# Altium project Quadcopter_v2.0.PrjPCB
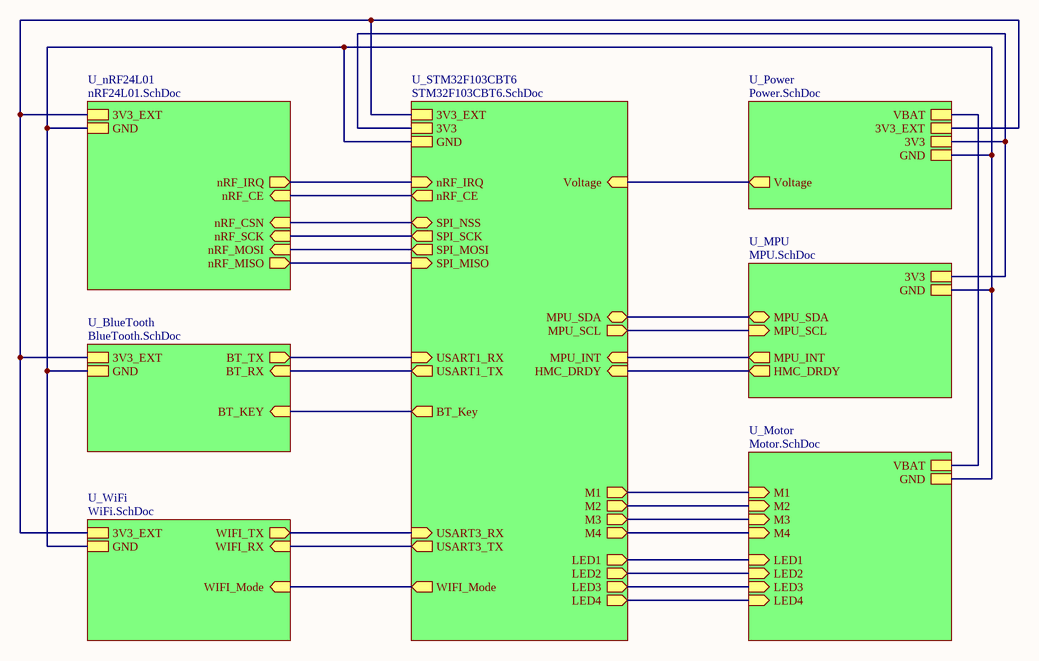
[diagram p0: Quadcopter.SchDoc]
7 sheets, 76 parts. Net scope: hierarchical (ports join the sheet entries above them; power ports are global).
Board file: Quadcopter.PcbDoc
Sheets:
  Quadcopter.SchDoc
    U_STM32F103CBT6 = STM32F103CBT6.SchDoc
    U_MPU = MPU.SchDoc
    U_Motor = Motor.SchDoc
    U_Power = Power.SchDoc
    U_BlueTooth = BlueTooth.SchDoc
    U_WiFi = WiFi.SchDoc

## Sheet Quadcopter.SchDoc
size A; PageSetup: Record=PageOptions|CenterHorizontal=True|CenterVertical=True|PrintScale=1.00|XCorrection=1.00|YCorrection=1.00|PrintKind=1|BorderSize=5000000|LeftOffset=0|BottomOffset=0|Orientation=2|PaperLength=1000|PaperWidth=1000|Scale=100|PaperSource=7|PrintQuality=-3|MediaType=1|DitherType=10|PrintScaleMode=1|PaperKind=A3|PaperIndex=8

### Sub-sheets
U_BlueTooth = BlueTooth.SchDoc: 3V3_EXT, GND, BT_RX (in), BT_TX (out), BT_KEY (in)
U_Motor = Motor.SchDoc: M1 (in), M2 (in), M3 (in), M4 (in), GND, VBAT, LED1 (in), LED2 (in), LED3 (in), LED4 (in)
U_MPU = MPU.SchDoc: MPU_INT (out), 3V3, GND, MPU_SDA (bidir), MPU_SCL (in), HMC_DRDY (out)
U_nRF24L01 = nRF24L01.SchDoc (file not in this document): 3V3_EXT, GND, nRF_CSN (in), nRF_CE (in), nRF_SCK (in), nRF_MISO (out), nRF_MOSI (in), nRF_IRQ (out)
U_Power = Power.SchDoc: 3V3_EXT, GND, 3V3, VBAT, Voltage (out)
U_STM32F103CBT6 = STM32F103CBT6.SchDoc: Voltage (in), MPU_SCL (out), MPU_SDA (bidir), 3V3_EXT, GND, 3V3, M1 (out), M2 (out), M3 (out), M4 (out), LED1 (out), LED2 (out), LED3 (out), LED4 (out), WIFI_Mode (out), SPI_MISO (in), SPI_MOSI (out), SPI_SCK (out), SPI_NSS (bidir), MPU_INT (in), HMC_DRDY (in), USART1_TX (out), USART1_RX (in), USART3_TX (out), USART3_RX (in), BT_Key (out), nRF_IRQ (in), nRF_CE (out)
U_WiFi = WiFi.SchDoc: WIFI_Mode (in), WIFI_RX (in), WIFI_TX (out), 3V3_EXT, GND

### Nets
3V3: sheet U_STM32F103CBT6/3V3, sheet U_MPU/3V3, sheet U_Power/3V3
3V3_EXT: sheet U_STM32F103CBT6/3V3_EXT, sheet U_Power/3V3_EXT, sheet U_nRF24L01/3V3_EXT, sheet U_BlueTooth/3V3_EXT, sheet U_WiFi/3V3_EXT
GND: sheet U_STM32F103CBT6/GND, sheet U_MPU/GND, sheet U_Motor/GND, sheet U_Power/GND, sheet U_nRF24L01/GND, sheet U_BlueTooth/GND, sheet U_WiFi/GND
VBAT: sheet U_Motor/VBAT, sheet U_Power/VBAT
RX1: sheet U_STM32F103CBT6/USART1_RX, sheet U_BlueTooth/BT_TX
TX1: sheet U_STM32F103CBT6/USART1_TX, sheet U_BlueTooth/BT_RX
NetD12_1: sheet U_STM32F103CBT6/Voltage, sheet U_Power/Voltage
NetIC1_21: sheet U_STM32F103CBT6/USART3_TX, sheet U_WiFi/WIFI_RX
NetIC1_22: sheet U_STM32F103CBT6/USART3_RX, sheet U_WiFi/WIFI_TX
NetQ1_1: sheet U_STM32F103CBT6/M1, sheet U_Motor/M1
NetQ2_1: sheet U_STM32F103CBT6/M2, sheet U_Motor/M2
NetQ3_1: sheet U_STM32F103CBT6/M3, sheet U_Motor/M3
NetQ4_1: sheet U_STM32F103CBT6/M4, sheet U_Motor/M4
NetR3_1: sheet U_STM32F103CBT6/WIFI_Mode, sheet U_WiFi/WIFI_Mode
NetR6_2: sheet U_STM32F103CBT6/BT_Key, sheet U_BlueTooth/BT_KEY
NetR9_1: sheet U_STM32F103CBT6/LED1, sheet U_Motor/LED1
NetR10_1: sheet U_STM32F103CBT6/LED2, sheet U_Motor/LED2
NetR11_1: sheet U_STM32F103CBT6/LED3, sheet U_Motor/LED3
NetR12_1: sheet U_STM32F103CBT6/LED4, sheet U_Motor/LED4
NetR17_1: sheet U_STM32F103CBT6/MPU_SDA, sheet U_MPU/MPU_SDA
NetR18_1: sheet U_STM32F103CBT6/MPU_SCL, sheet U_MPU/MPU_SCL
NetU1_12: sheet U_STM32F103CBT6/MPU_INT, sheet U_MPU/MPU_INT
NetU2_15: sheet U_STM32F103CBT6/HMC_DRDY, sheet U_MPU/HMC_DRDY
NetU5_2: sheet U_STM32F103CBT6/nRF_IRQ, sheet U_nRF24L01/nRF_IRQ
NetU5_14: sheet U_STM32F103CBT6/SPI_NSS, sheet U_nRF24L01/nRF_CSN
NetU5_15: sheet U_STM32F103CBT6/SPI_SCK, sheet U_nRF24L01/nRF_SCK
NetU5_16: sheet U_STM32F103CBT6/SPI_MISO, sheet U_nRF24L01/nRF_MISO
NetU5_17: sheet U_STM32F103CBT6/SPI_MOSI, sheet U_nRF24L01/nRF_MOSI
NetU5_19: sheet U_STM32F103CBT6/nRF_CE, sheet U_nRF24L01/nRF_CE

## Sheet STM32F103CBT6.SchDoc
size A
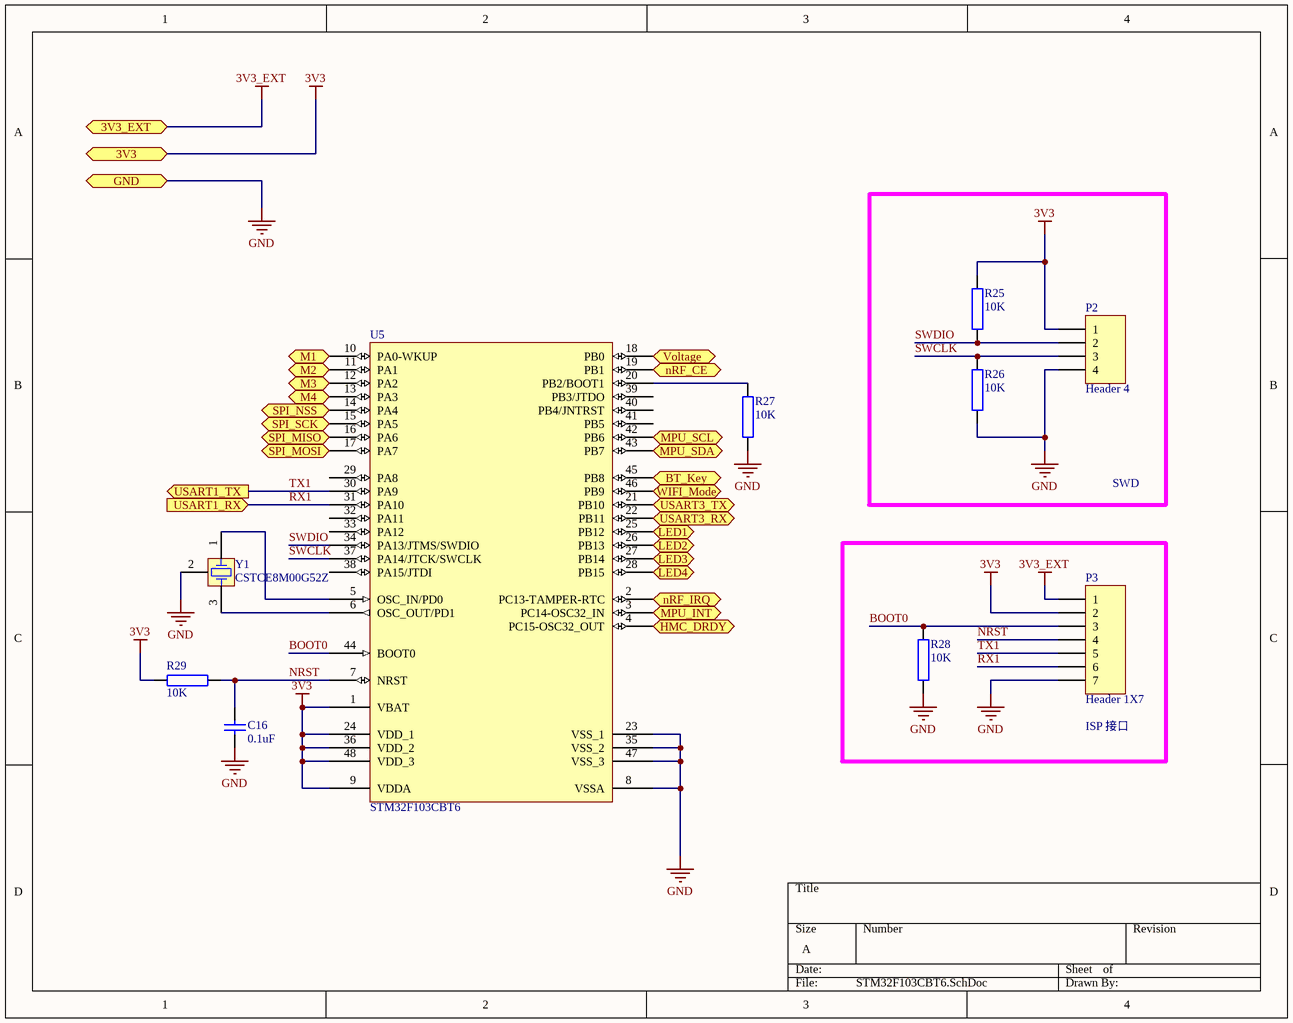
[diagram p1: STM32F103CBT6.SchDoc]

### Parts
C16  0.1uF  [C0603]
P2  Header 4  [HDR1X4]
P3  Header 1X7  [HDR1X7]
R25  10K  [R0603]
R26  10K  [R0603]
R27  10K  [R0603]
R28  10K  [R0603]
R29  10K  [R0603]
U5  STM32F103CBT6  [LQFP48_N]
Y1  CSTCE8M00G52Z  [X8MCSTCR]

### Blocks framed on the sheet
SWD: P2 R25 R26
ISP 接口: P3 R28

### Ports
3V3, 3V3_EXT, BT_Key (out), GND, HMC_DRDY (in), LED1 (out), LED2 (out), LED3 (out), LED4 (out), M1 (out), M2 (out), M3 (out), M4 (out), MPU_INT (in), MPU_SCL (out), MPU_SDA (bidir), nRF_CE (out), nRF_IRQ (in), SPI_MISO (in), SPI_MOSI (out), SPI_NSS (bidir), SPI_SCK (out), USART1_RX (in), USART1_TX (out), USART3_RX (in), USART3_TX (out), Voltage (in), WIFI_Mode (out)

### Nets
3V3: P2.1 P3.2 R25.2 R29.1 U5.1(VBAT) U5.9(VDDA) U5.24(VDD_1) U5.36(VDD_2) U5.48(VDD_3) ; port 3V3
3V3_EXT: P3.1 ; port 3V3_EXT
GND: C16.1 P2.4 P3.7 R26.1 R27.1 R28.2 U5.8(VSSA) U5.23(VSS_1) U5.35(VSS_2) U5.47(VSS_3) Y1.2(COM) ; port GND
BOOT0: P3.3 R28.1 U5.44(BOOT0)
NRST: C16.2 P3.4 R29.2 U5.7(NRST)
RX1: P3.6 U5.31(PA10) ; port USART1_RX
SWCLK: P2.3 R26.2 U5.37(PA14/JTCK/SWCLK)
SWDIO: P2.2 R25.1 U5.34(PA13/JTMS/SWDIO)
TX1: P3.5 U5.30(PA9) ; port USART1_TX
NetD12_1: U5.18(PB0) ; port Voltage
NetIC1_21: U5.21(PB10) ; port USART3_TX
NetIC1_22: U5.22(PB11) ; port USART3_RX
NetQ1_1: U5.10(PA0-WKUP) ; port M1
NetQ2_1: U5.11(PA1) ; port M2
NetQ3_1: U5.12(PA2) ; port M3
NetQ4_1: U5.13(PA3) ; port M4
NetR3_1: U5.46(PB9) ; port WIFI_Mode
NetR6_2: U5.45(PB8) ; port BT_Key
NetR9_1: U5.25(PB12) ; port LED1
NetR10_1: U5.26(PB13) ; port LED2
NetR11_1: U5.27(PB14) ; port LED3
NetR12_1: U5.28(PB15) ; port LED4
NetR17_1: U5.43(PB7) ; port MPU_SDA
NetR18_1: U5.42(PB6) ; port MPU_SCL
NetR27_2: R27.2 U5.20(PB2/BOOT1)
NetU1_12: U5.3(PC14-OSC32_IN) ; port MPU_INT
NetU2_15: U5.4(PC15-OSC32_OUT) ; port HMC_DRDY
NetU5_2: U5.2(PC13-TAMPER-RTC) ; port nRF_IRQ
NetU5_5: U5.5(OSC_IN/PD0) Y1.1(OSC1)
NetU5_6: U5.6(OSC_OUT/PD1) Y1.3(OSC2)
NetU5_14: U5.14(PA4) ; port SPI_NSS
NetU5_15: U5.15(PA5) ; port SPI_SCK
NetU5_16: U5.16(PA6) ; port SPI_MISO
NetU5_17: U5.17(PA7) ; port SPI_MOSI
NetU5_19: U5.19(PB1) ; port nRF_CE

Not connected (* = marked no-connect by the designer): U5 29(PA8) 32(PA11) 33(PA12) 38(PA15/JTDI) 39(PB3/JTDO) 40(PB4/JNTRST) 41(PB5)

### Library data of the parts
C16 = Cap: Capacitor (Semiconductor SIM Model); Published: 8-Jun-2000; LatestRevisionDate: 29-May-2009; LatestRevisionNote: IPC-7351 Footprint Added.; PackageReference: C0603; Publisher: Altium Limited; PackageDescription: Chip Capacitor; Value: 0.1uF
P2 = Header 4: Header, 4-Pin; LatestRevisionDate: 17-Jul-2002; LatestRevisionNote: Re-released for DXP Platform.; Publisher: Altium Limited
P3 = Header 1X7: Header, 7-Pin; LatestRevisionDate: 17-Jul-2002; LatestRevisionNote: Re-released for DXP Platform.; Publisher: Altium Limited
R25-R29 = Res3: Resistor; Published: 8-Jun-2000; LatestRevisionDate: 29-May-2009; LatestRevisionNote: IPC-7351 Footprint Added.; PackageReference: R0603; Publisher: Altium Limited; PackageDescription: Chip Resistor; Value: 10K
U5 = STM32F103CBT6: STM32 ARM-based 32-bit MCU with 128 Kbytes Flash, 48-pin LQFP, Industrial Temperature; Published: 30-May-2008; DatasheetVersion: rev6, Mar-2008; PackageVersion: Mar-2008; PackageReference: LQFP48; Publisher: Altium Limited; PackageDescription: 48-Pin Low-Profile Quad Flat Pack, 7 x 7 mm Body, 0.5 mm Pitch (LQFP48); ComponentLink1Description: Manufacturer Link; ComponentLink1URL: www.st.com/stm32; ComponentLink2Description: Datasheet; ComponentLink2URL: http://www.st.com/stonline/products/literature/ds/13587.pdf
Y1 = CSTCE8M00G52Z: Crystal Oscillator, 3rd In-Line Lead Version

## Sheet MPU.SchDoc
size A
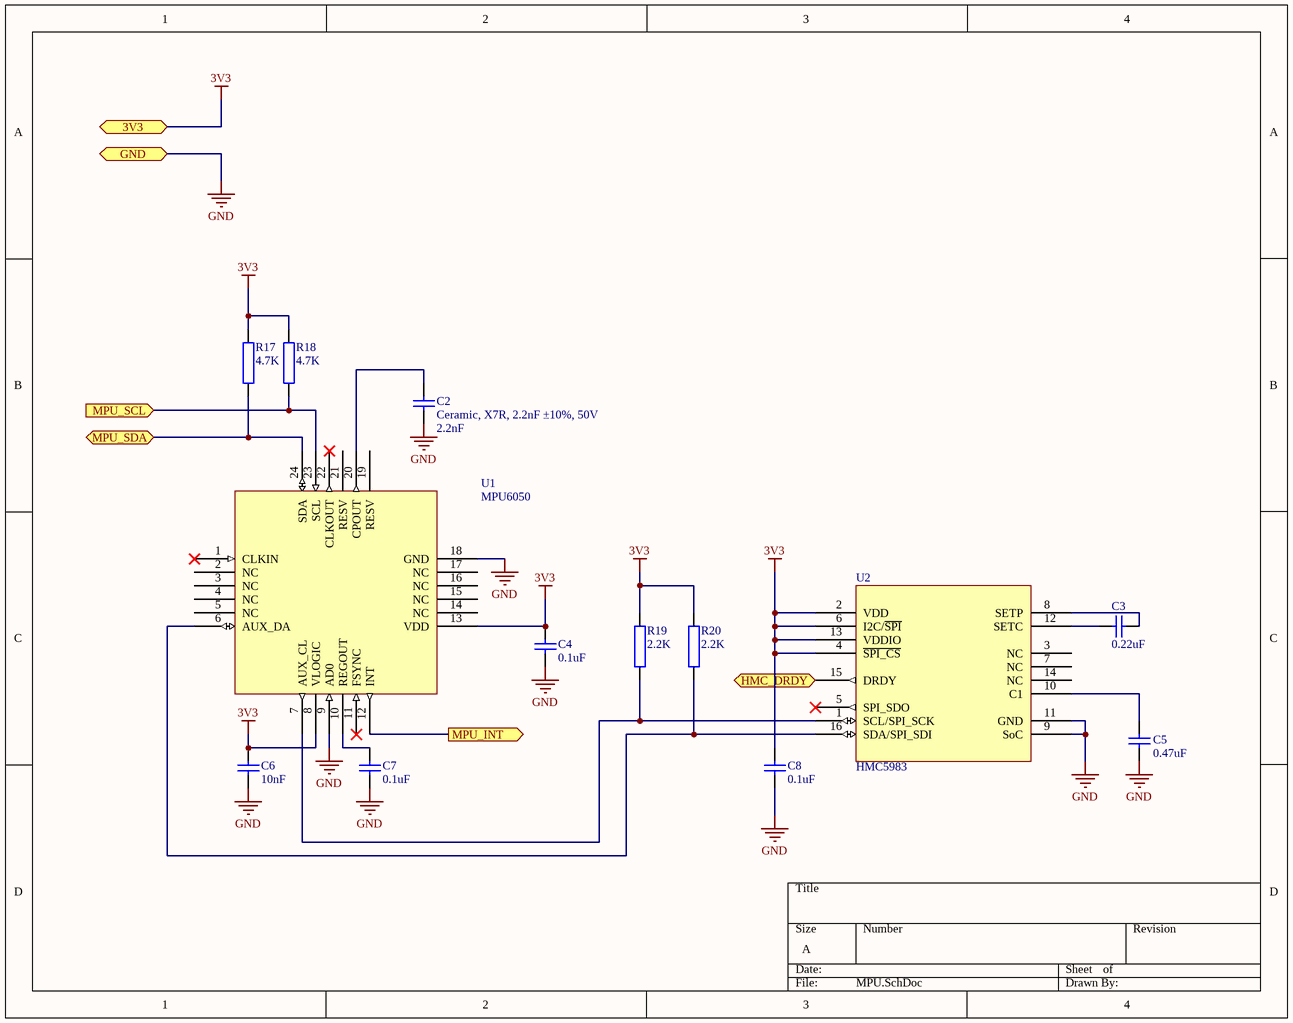
[diagram p2: MPU.SchDoc]

### Parts
C2  Ceramic, X7R, 2.2nF ±10%, 50V  value 2.2nF  [C0603]
C3  0.22uF  [C0603]
C4  0.1uF  [C0603]
C5  0.47uF  [C0603]
C6  10nF  [C0603]
C7  0.1uF  [C0603]
C8  0.1uF  [C0603]
R17  4.7K  [R0603]
R18  4.7K  [R0603]
R19  2.2K  [R0603]
R20  2.2K  [R0603]
U1  MPU6050  [24 Lead QFN]
U2  HMC5983  [16 Lead QFN 2]

### Ports
3V3, GND, HMC_DRDY (out), MPU_INT (out), MPU_SCL (in), MPU_SDA (bidir)

### Nets
3V3: C4.2 C6.2 C8.2 R17.2 R18.2 R19.2 R20.2 U1.8(VLOGIC) U1.13(VDD) U2.2(VDD) U2.4(~{SPI_CS}) U2.6(I2C/~{SPI}) U2.13(VDDIO) ; port 3V3
GND: C2.1 C4.1 C5.1 C6.1 C7.1 C8.1 U1.9(AD0) U1.18(GND) U2.9(SoC) U2.11(GND) ; port GND
NetC2_2: C2.2 U1.20(CPOUT)
NetC3_1: C3.1 U2.8(SETP)
NetC3_2: C3.2 U2.12(SETC)
NetC5_2: C5.2 U2.10(C1)
NetC7_2: C7.2 U1.10(REGOUT)
NetR17_1: R17.1 U1.24(SDA) ; port MPU_SDA
NetR18_1: R18.1 U1.23(SCL) ; port MPU_SCL
NetR19_1: R19.1 U1.7(AUX_CL) U2.1(SCL/SPI_SCK)
NetR20_1: R20.1 U1.6(AUX_DA) U2.16(SDA/SPI_SDI)
NetU1_12: U1.12(INT) ; port MPU_INT
NetU2_15: U2.15(DRDY) ; port HMC_DRDY

Not connected (* = marked no-connect by the designer): U1 1(CLKIN)* 2(NC) 3(NC) 4(NC) 5(NC) 11(FSYNC)* 14(NC) 15(NC) 16(NC) 17(NC) 19(RESV) 21(RESV) 22(CLKOUT)*; U2 3(NC) 5(SPI_SDO)* 7(NC) 14(NC)

### Library data of the parts
C2-C8 = Cap: Capacitor (Semiconductor SIM Model); Published: 8-Jun-2000; LatestRevisionDate: 29-May-2009; LatestRevisionNote: IPC-7351 Footprint Added.; PackageReference: C0603; Publisher: Altium Limited; PackageDescription: Chip Capacitor
  C3: Value: 0.22uF
  C4 C7 C8: Value: 0.1uF
  C5: Value: 0.47uF
  C6: Value: 10nF
R17-R20 = Res3: Resistor; Published: 8-Jun-2000; LatestRevisionDate: 29-May-2009; LatestRevisionNote: IPC-7351 Footprint Added.; PackageReference: R0603; Publisher: Altium Limited; PackageDescription: Chip Resistor
  R17 R18: Value: 4.7K
  R19 R20: Value: 2.2K
U1 = MPU6050: MPU6050, 24pin
U2 = HMC5983: HMC5983, 16pin

## Sheet Motor.SchDoc
size A
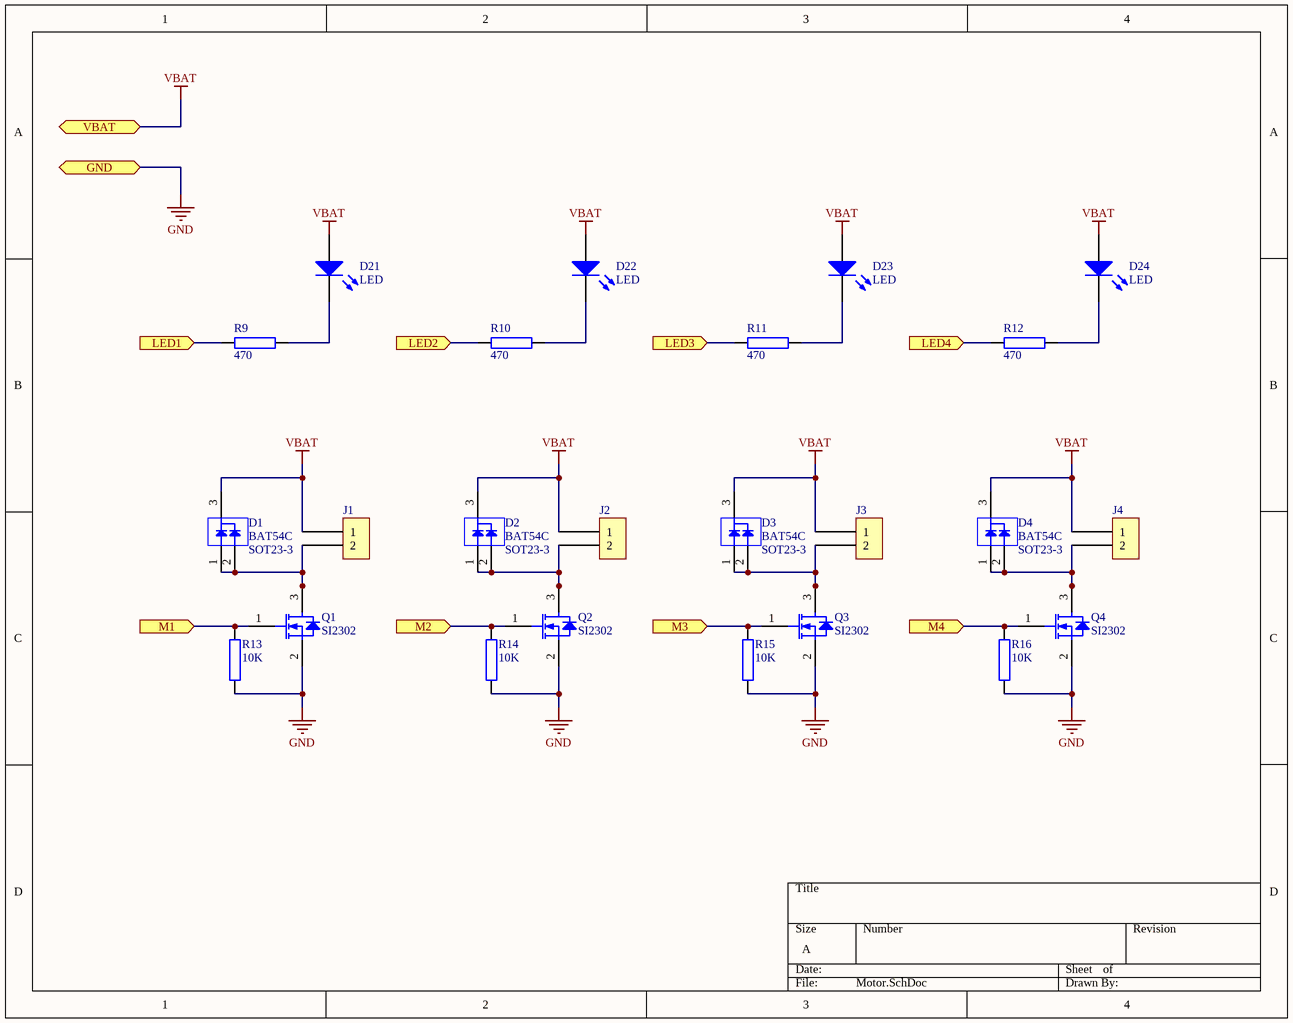
[diagram p3: Motor.SchDoc]

### Parts
D1  BAT54C  [SOT23-3]
D2  BAT54C  [SOT23-3]
D3  BAT54C  [SOT23-3]
D4  BAT54C  [SOT23-3]
D21  LED  [LED_0603]
D22  LED  [LED_0603]
D23  LED  [LED_0603]
D24  LED  [LED_0603]
J1  motor bonding pad  [Motor_Pin_Pad]  (value not drawn)
J2  motor bonding pad  [Motor_Pin_Pad]  (value not drawn)
J3  motor bonding pad  [Motor_Pin_Pad]  (value not drawn)
J4  motor bonding pad  [Motor_Pin_Pad]  (value not drawn)
Q1  SI2302  [SOT23-3]
Q2  SI2302  [SOT23-3]
Q3  SI2302  [SOT23-3]
Q4  SI2302  [SOT23-3]
R9  470  [R0603]
R10  470  [R0603]
R11  470  [R0603]
R12  470  [R0603]
R13  10K  [R0603]
R14  10K  [R0603]
R15  10K  [R0603]
R16  10K  [R0603]

### Ports
GND, LED1 (in), LED2 (in), LED3 (in), LED4 (in), M1 (in), M2 (in), M3 (in), M4 (in), VBAT

### Nets
GND: Q1.2(S) Q2.2(S) Q3.2(S) Q4.2(S) R13.1 R14.1 R15.1 R16.1 ; port GND
VBAT: D1.3 D2.3 D3.3 D4.3 D21.1(A) D22.1(A) D23.1(A) D24.1(A) J1.1 J2.1 J3.1 J4.1 ; port VBAT
NetD1_1: D1.1 D1.2 J1.2 Q1.3(D)
NetD2_1: D2.1 D2.2 J2.2 Q2.3(D)
NetD3_1: D3.1 D3.2 J3.2 Q3.3(D)
NetD4_1: D4.1 D4.2 J4.2 Q4.3(D)
NetD21_2: D21.2(K) R9.2
NetD22_2: D22.2(K) R10.2
NetD23_2: D23.2(K) R11.2
NetD24_2: D24.2(K) R12.2
NetQ1_1: Q1.1(G) R13.2 ; port M1
NetQ2_1: Q2.1(G) R14.2 ; port M2
NetQ3_1: Q3.1(G) R15.2 ; port M3
NetQ4_1: Q4.1(G) R16.2 ; port M4
NetR9_1: R9.1 ; port LED1
NetR10_1: R10.1 ; port LED2
NetR11_1: R11.1 ; port LED3
NetR12_1: R12.1 ; port LED4

### Library data of the parts
D21-D24 = LED: Typical INFRARED GaAs LED; Published: 8-Jun-2000; LatestRevisionDate: 08-Jul-2005; LatestRevisionNote: Mech Layer 1 removed.; PackageReference: LED-0; Publisher: Altium Limited; PackageDescription: LED; 2 Leads
J1-J4 = Joint_Motor
Q1-Q4 = SI2302: N-Channel MOSFET; Published: 8-Jun-2000; LatestRevisionDate: 17-Jul-2002; LatestRevisionNote: Re-released for DXP Platform.; PackageVersion: 1995/1996; PackageReference: SOT23-3; Publisher: Altium Limited; PackageDescription: TO, Flat Index; 3 In-Line, Axial Leads; Body Dia. 4.6mm; Lead Dia. 0.5 mm (max)
R9-R16 = Res3: Resistor; Published: 8-Jun-2000; LatestRevisionDate: 29-May-2009; LatestRevisionNote: IPC-7351 Footprint Added.; PackageReference: R0603; Publisher: Altium Limited; PackageDescription: Chip Resistor
  R9-R12: Value: 470
  R13-R16: Value: 10K

## Sheet Power.SchDoc
size A
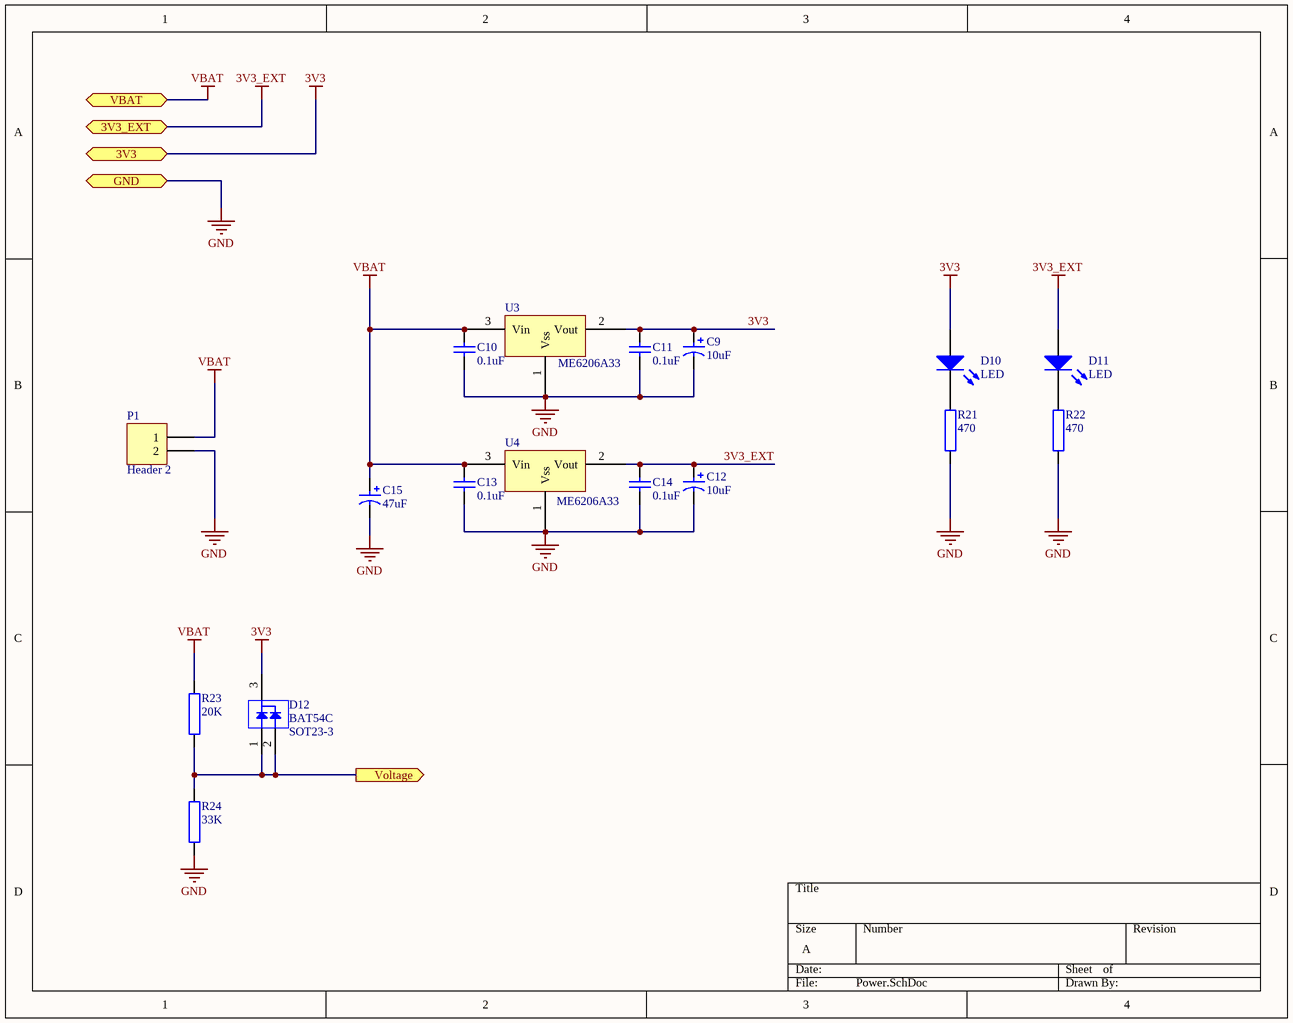
[diagram p4: Power.SchDoc]

### Parts
C9  10uF  [Cap_Ta_A_Case]
C10  0.1uF  [C0603]
C11  0.1uF  [C0603]
C12  10uF  [Cap_Ta_A_Case]
C13  0.1uF  [C0603]
C14  0.1uF  [C0603]
C15  47uF  [Cap_Ta_B_Case]
D10  LED  [LED_0603]
D11  LED  [LED_0603]
D12  BAT54C  [SOT23-3]
P1  Header 2  [HDR1X2]
R21  470  [R0603]
R22  470  [R0603]
R23  20K  [r0603]
R24  33K  [r0603]
U3  ME6206A33  [SOT23-3]
U4  ME6206A33  [SOT23-3]

### Ports
3V3, 3V3_EXT, GND, VBAT, Voltage (out)

### Nets
3V3: C9.1 C11.1 D10.1(A) D12.3 U3.2(Vout) ; port 3V3
3V3_EXT: C12.1 C14.1 D11.1(A) U4.2(Vout) ; port 3V3_EXT
GND: C9.2 C10.2 C11.2 C12.2 C13.2 C14.2 C15.2 P1.2 R21.1 R22.1 R24.1 U3.1(Vss) U4.1(Vss) ; port GND
VBAT: C10.1 C13.1 C15.1 P1.1 R23.2 U3.3(Vin) U4.3(Vin) ; port VBAT
NetD10_2: D10.2(K) R21.2
NetD11_2: D11.2(K) R22.2
NetD12_1: D12.1 D12.2 R23.1 R24.2 ; port Voltage

### Library data of the parts
C9 C12 C15 = Cap Tantalum: Polarized Capacitor (Surface Mount); Published: 8-Jun-2000; LatestRevisionDate: 29-May-2009; LatestRevisionNote: IPC-7351 Footprint Added.; PackageReference: Cap_Ta_A_Case; Publisher: Altium Limited; PackageDescription: Chip Capacitor
  C9 C12: Value: 10uF
  C15: Value: 47uF
C10 C11 C13 C14 = Cap: Capacitor (Semiconductor SIM Model); Published: 8-Jun-2000; LatestRevisionDate: 29-May-2009; LatestRevisionNote: IPC-7351 Footprint Added.; PackageReference: C0603; Publisher: Altium Limited; PackageDescription: Chip Capacitor; Value: 0.1uF
D10 D11 = LED: Typical INFRARED GaAs LED; Published: 8-Jun-2000; LatestRevisionDate: 08-Jul-2005; LatestRevisionNote: Mech Layer 1 removed.; PackageReference: LED-0; Publisher: Altium Limited; PackageDescription: LED; 2 Leads
P1 = Header 2: Header, 2-Pin; LatestRevisionDate: 17-Jul-2002; LatestRevisionNote: Re-released for DXP Platform.; Publisher: Altium Limited
R21-R24 = Res3: Resistor; Published: 8-Jun-2000; LatestRevisionDate: 29-May-2009; LatestRevisionNote: IPC-7351 Footprint Added.; PackageReference: R0603; Publisher: Altium Limited; PackageDescription: Chip Resistor
  R21 R22: Value: 470
  R23: Value: 20K
  R24: Value: 33K
U3 U4 = ME6206: ME6206A33, SOT23

## Sheet BlueTooth.SchDoc
size A
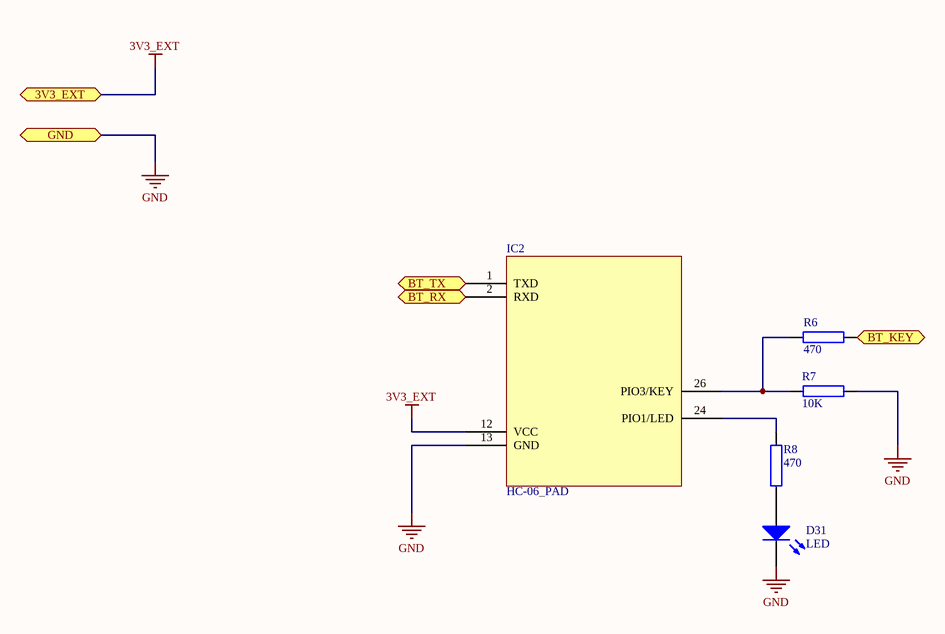
[diagram p5: BlueTooth.SchDoc]

### Parts
D31  LED  [LED_0603]
IC2  HC-06_PAD  [HC-0X_PAD]
R6  470  [R0603]
R7  10K  [R0603]
R8  470  [R0603]

### Ports
3V3_EXT, BT_KEY (in), BT_RX (in), BT_TX (out), GND

### Nets
3V3_EXT: IC2.12(VCC) ; port 3V3_EXT
GND: D31.2(K) IC2.13(GND) R7.2 ; port GND
RX1: IC2.1(TXD) ; port BT_TX
TX1: IC2.2(RXD) ; port BT_RX
NetD31_1: D31.1(A) R8.1
NetIC2_24: IC2.24(PIO1/LED) R8.2
NetIC2_26: IC2.26(PIO3/KEY) R6.1 R7.1
NetR6_2: R6.2 ; port BT_KEY

### Library data of the parts
D31 = LED: Typical INFRARED GaAs LED; Published: 8-Jun-2000; LatestRevisionDate: 08-Jul-2005; LatestRevisionNote: Mech Layer 1 removed.; PackageReference: LED-0; Publisher: Altium Limited; PackageDescription: LED; 2 Leads
R6-R8 = Res3: Resistor; Published: 8-Jun-2000; LatestRevisionDate: 29-May-2009; LatestRevisionNote: IPC-7351 Footprint Added.; PackageReference: R0603; Publisher: Altium Limited; PackageDescription: Chip Resistor
  R6 R8: Value: 470
  R7: Value: 10K

## Sheet WiFi.SchDoc
size A; PageSetup: Record=PageOptions|CenterHorizontal=True|CenterVertical=True|PrintScale=1.00|XCorrection=1.00|YCorrection=1.00|PrintKind=1|BorderSize=5000000|LeftOffset=0|BottomOffset=0|Orientation=2|PaperLength=1000|PaperWidth=1000|Scale=100|PaperSource=7|PrintQuality=-3|MediaType=1|DitherType=10|PrintScaleMode=1|PaperKind=Letter|PaperIndex=1
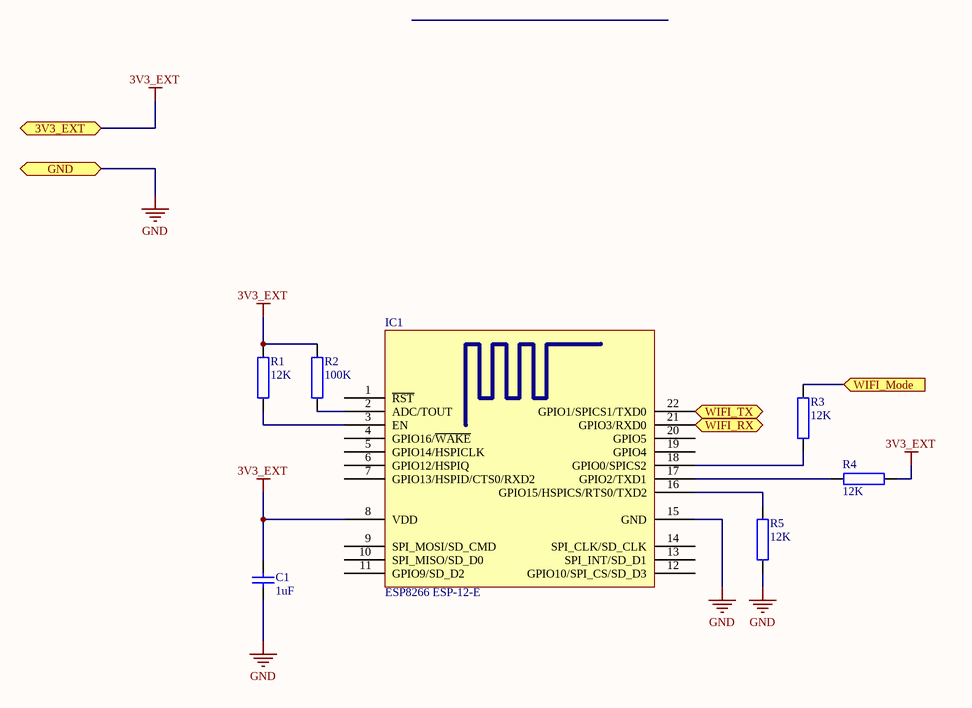
[diagram p6: WiFi.SchDoc]

### Parts
C1  1uF  [C0603]
IC1  ESP8266 ESP-12-E  [ESP_12_E]
R1  12K  [R0603]
R2  100K  [R0603]
R3  12K  [R0603]
R4  12K  [R0603]
R5  12K  [R0603]

### Ports
3V3_EXT, GND, WIFI_Mode (in), WIFI_RX (in), WIFI_TX (out)

### Nets
3V3_EXT: C1.2 IC1.8(VDD) R1.2 R2.2 R4.1 ; port 3V3_EXT
GND: C1.1 IC1.15(GND) R5.2 ; port GND
NetIC1_2: IC1.2(ADC/TOUT) R2.1
NetIC1_3: IC1.3(EN) R1.1
NetIC1_16: IC1.16(GPIO15/HSPICS/RTS0/TXD2) R5.1
NetIC1_17: IC1.17(GPIO2/TXD1) R4.2
NetIC1_18: IC1.18(GPIO0/SPICS2) R3.2
NetIC1_21: IC1.21(GPIO3/RXD0) ; port WIFI_RX
NetIC1_22: IC1.22(GPIO1/SPICS1/TXD0) ; port WIFI_TX
NetR3_1: R3.1 ; port WIFI_Mode

Not connected (* = marked no-connect by the designer): IC1 1(~{RST}) 4(GPIO16/~{WAKE}) 5(GPIO14/HSPICLK) 6(GPIO12/HSPIQ) 7(GPIO13/HSPID/CTS0/RXD2) 9(SPI_MOSI/SD_CMD) 10(SPI_MISO/SD_D0) 11(GPIO9/SD_D2) 12(GPIO10/SPI_CS/SD_D3) 13(SPI_INT/SD_D1) 14(SPI_CLK/SD_CLK) 19(GPIO4) 20(GPIO5)

### Library data of the parts
C1 = Cap: Capacitor (Semiconductor SIM Model); Published: 8-Jun-2000; LatestRevisionDate: 29-May-2009; LatestRevisionNote: IPC-7351 Footprint Added.; PackageReference: C0603; Publisher: Altium Limited; PackageDescription: Chip Capacitor; Value: 1uF
R1-R5 = Res3: Resistor; Published: 8-Jun-2000; LatestRevisionDate: 29-May-2009; LatestRevisionNote: IPC-7351 Footprint Added.; PackageReference: R0603; Publisher: Altium Limited; PackageDescription: Chip Resistor
  R1 R3-R5: Value: 12K
  R2: Value: 100K

## Nets that join several sheets
3V3: STM32F103CBT6 (9 pins), MPU (13 pins), Power (5 pins)
3V3_EXT: STM32F103CBT6 (P3.1), Power (C12.1 C14.1 D11.1 U4.2), BlueTooth (IC2.12), WiFi (5 pins)
GND: STM32F103CBT6 (11 pins), MPU (10 pins), Motor (8 pins), Power (13 pins), BlueTooth (D31.2 IC2.13 R7.2), WiFi (C1.1 IC1.15 R5.2)
VBAT: Motor (12 pins), Power (7 pins)
NetD12_1: STM32F103CBT6 (U5.18), Power (D12.1 D12.2 R23.1 R24.2)
NetIC1_21: STM32F103CBT6 (U5.21), WiFi (IC1.21)
NetIC1_22: STM32F103CBT6 (U5.22), WiFi (IC1.22)
NetQ1_1: STM32F103CBT6 (U5.10), Motor (Q1.1 R13.2)
NetQ2_1: STM32F103CBT6 (U5.11), Motor (Q2.1 R14.2)
NetQ3_1: STM32F103CBT6 (U5.12), Motor (Q3.1 R15.2)
NetQ4_1: STM32F103CBT6 (U5.13), Motor (Q4.1 R16.2)
NetR3_1: STM32F103CBT6 (U5.46), WiFi (R3.1)
NetR6_2: STM32F103CBT6 (U5.45), BlueTooth (R6.2)
NetR9_1: STM32F103CBT6 (U5.25), Motor (R9.1)
NetR10_1: STM32F103CBT6 (U5.26), Motor (R10.1)
NetR11_1: STM32F103CBT6 (U5.27), Motor (R11.1)
NetR12_1: STM32F103CBT6 (U5.28), Motor (R12.1)
NetR17_1: STM32F103CBT6 (U5.43), MPU (R17.1 U1.24)
NetR18_1: STM32F103CBT6 (U5.42), MPU (R18.1 U1.23)
NetU1_12: STM32F103CBT6 (U5.3), MPU (U1.12)
NetU2_15: STM32F103CBT6 (U5.4), MPU (U2.15)
RX1: STM32F103CBT6 (P3.6 U5.31), BlueTooth (IC2.1)
TX1: STM32F103CBT6 (P3.5 U5.30), BlueTooth (IC2.2)